# EAGLE design FInal_Board_Tesis_mini_4 (EAGLE 7.5.0)
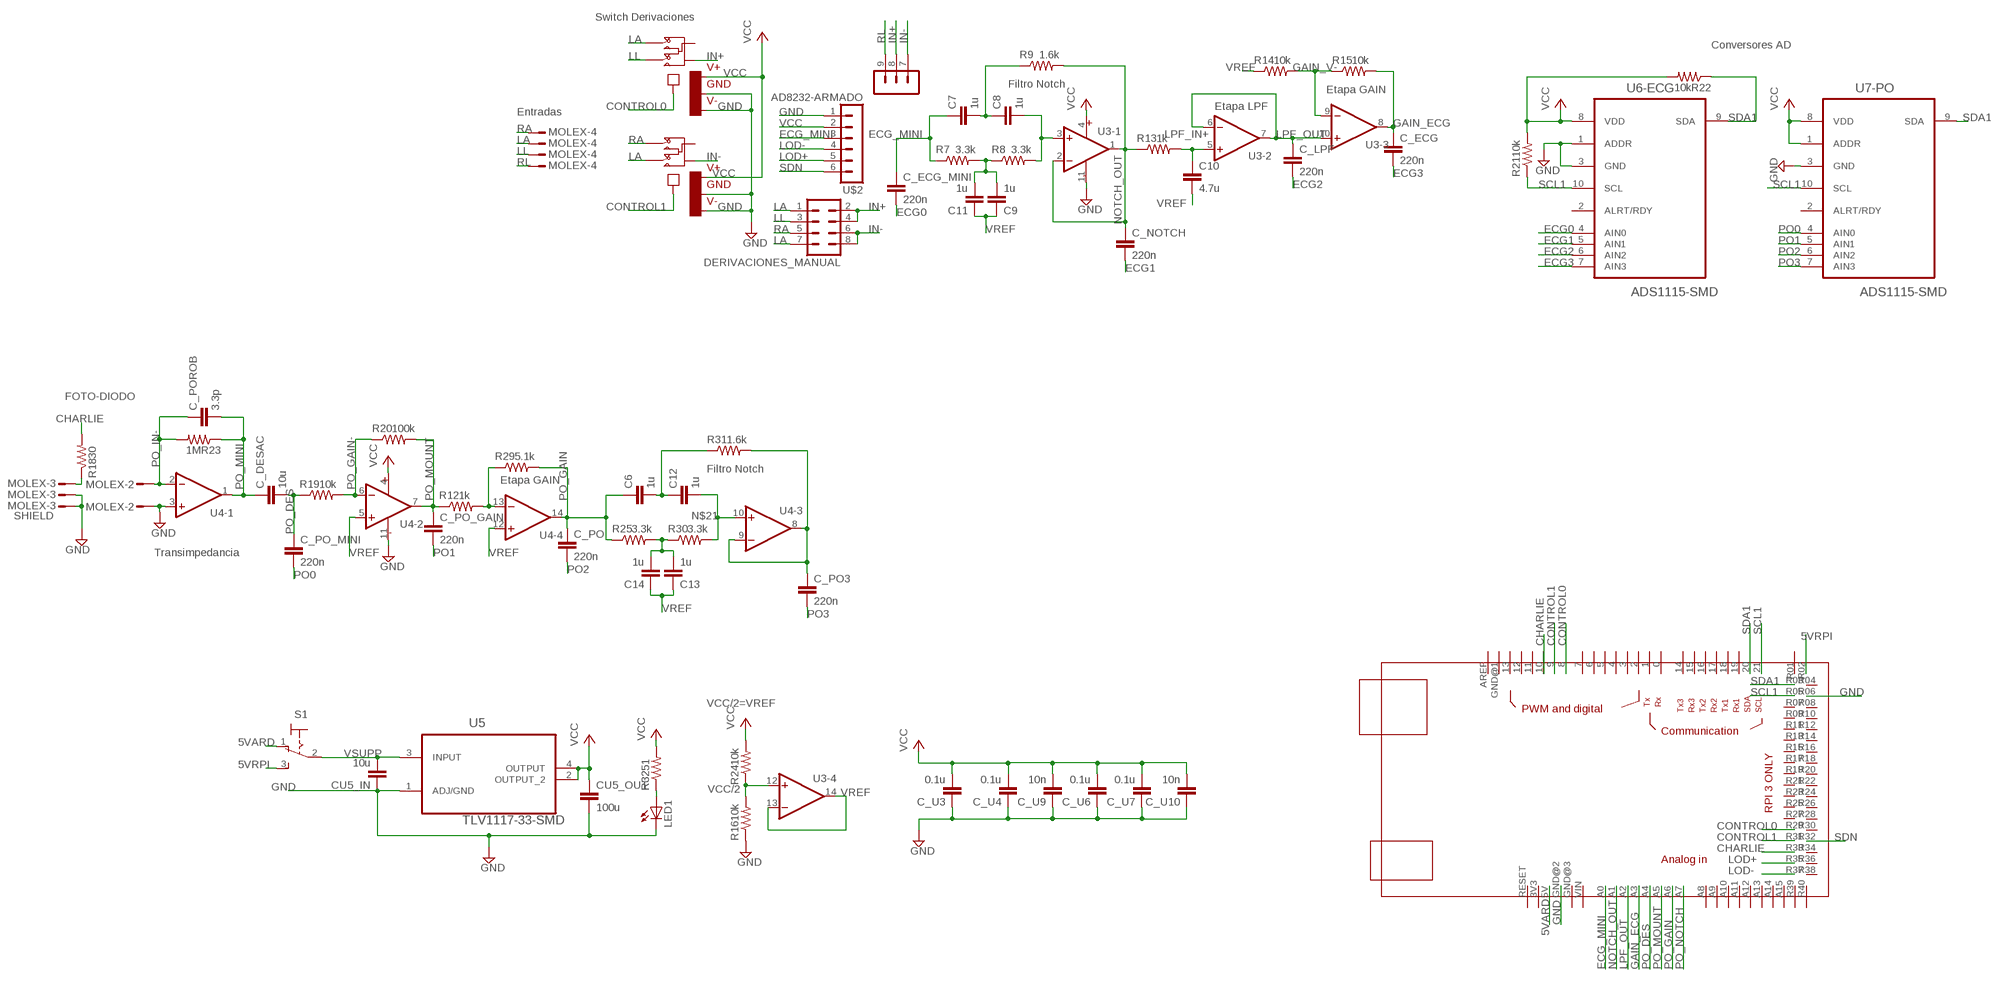
[diagram p0: schematic, sheet 1]

## Parts
C6  1u  C-EUC0805  [C0805]
C7  1u  C-EUC0805  [C0805]
C8  1u  C-EUC0805  [C0805]
C9  1u  C-EUC0805  [C0805]
C10  4.7u  C-EUC0805  [C0805]
C11  1u  C-EUC0805  [C0805]
C12  1u  C-EUC0805  [C0805]
C13  1u  C-EUC0805  [C0805]
C14  1u  C-EUC0805  [C0805]
C_DESAC  10u  C-EUC0805  [C0805]
C_ECG  220n  C-EUC0805  [C0805]
C_ECG_MINI  220n  C-EUC0805  [C0805]
C_LPF  220n  C-EUC0805  [C0805]
C_NOTCH  220n  C-EUC0805  [C0805]
C_PO  220n  C-EUC0805  [C0805]
C_PO3  220n  C-EUC0805  [C0805]
C_PO_GAIN  220n  C-EUC0805  [C0805]
C_PO_MINI  220n  C-EUC0805  [C0805]
C_POROB  3.3p  C-EUC0805  [C0805]
C_U3  0.1u  C-EUC0805  [C0805]
C_U4  0.1u  C-EUC0805  [C0805]
C_U6  0.1u  C-EUC0805  [C0805]
C_U7  0.1u  C-EUC0805  [C0805]
C_U9  10n  C-EUC0805  [C0805]
C_U10  10n  C-EUC0805  [C0805]
CU5_IN  10u  C-EUC0805  [C0805]
CU5_OUT  100u  C-EUC0805  [C0805]
DERIVACIONES_MANUAL  MA04-2  [MA04-2]
LED1  LED_E  [LED_1206]
R7  3.3k  R-US_M3216  [M3216]
R8  3.3k  R-US_M3216  [M3216]
R9  1.6k  R-US_M3216  [M3216]
R12  1k  R-US_M3216  [M3216]
R13  1k  R-US_M3216  [M3216]
R14  10k  R-US_M3216  [M3216]
R15  10k  R-US_M3216  [M3216]
R16  10k  R-US_M3216  [M3216]
R18  30  R-US_M3216  [M3216]
R19  10k  R-US_M3216  [M3216]
R20  100k  R-US_M3216  [M3216]
R21  10k  R-US_M3216  [M3216]
R22  10k  R-US_M3216  [M3216]
R23  1M  R-US_M3216  [M3216]
R24  10k  R-US_M3216  [M3216]
R25  3.3k  R-US_M3216  [M3216]
R29  5.1k  R-US_M3216  [M3216]
R30  3.3k  R-US_M3216  [M3216]
R31  1.6k  R-US_M3216  [M3216]
R32  51  R-US_M3216  [M3216]
S1  320-916  [320-916]
U3  OPA4348-SMD  [14TSSOP]
U4  OPA4348-SMD  [14TSSOP]
U5  TLV1117-33-SMD  [SOT223]
U6-ECG  ADS1115-SMD  [10MSOP]
U7-PO  ADS1115-SMD  [10MSOP]
U9  MAX4528-SMD  [8MSOP-C/PTO]
U10  MAX4528-SMD  [8MSOP-C/PTO]
U$1  MEGA_DEVICE  [MEGABOX]
U$2  AD8232-ARMADO  [PINES-ECG]
U$3  MOLEX-3  [MOLEX-3]
U$4  MOLEX-2  [MOLEX-2]
U$5  MOLEX-4  [MOLEX-4]

## Nets
5VARD: S1.1(O) U$1.5V
5VRPI: S1.3(S) U$1.R02(5V1)
CHARLIE: R18.2 U$1.10 U$1.R33(GPIO13)
CONTROL0: U9.4(IN) U$1.8 U$1.R29(GPIO5)
CONTROL1: U10.4(IN) U$1.9 U$1.R31(GPIO6)
ECG0: C_ECG_MINI.2 U6-ECG.4(AIN0)
ECG1: C_NOTCH.2 U6-ECG.5(AIN1)
ECG2: C_LPF.2 U6-ECG.6(AIN2)
ECG3: C_ECG.2 U6-ECG.7(AIN3)
ECG_MINI: C7.1 C_ECG_MINI.1 R7.1 U$1.A0 U$2.3(OUT)
GAIN_ECG: C_ECG.1 R15.2 U3.8(-3:OUT) U$1.A3
GAIN_V-: R14.2 R15.1 U3.9(-3:-IN)
GND: C_U3.1 C_U4.1 C_U6.1 C_U7.1 C_U9.1 C_U10.1 CU5_IN.1 CU5_OUT.2 LED1.C R16.1 U3.11(V-) U4.3(-1:+IN) U4.11(V-) U5.1(ADJ/GND) U6-ECG.1(ADDR) U6-ECG.3(GND) U7-PO.3(GND) U9.3(GND) U9.5(V-) U10.3(GND) U10.5(V-) U$1.GND@2(GND) U$1.R06(GND) U$2.1(GND) U$3.2 U$3.3 U$4.2
IN+: DERIVACIONES_MANUAL.2 DERIVACIONES_MANUAL.4 U9.6(Y) U$2.8(LA)
IN-: DERIVACIONES_MANUAL.6 DERIVACIONES_MANUAL.8 U10.6(Y) U$2.7(RA)
LA: DERIVACIONES_MANUAL.1 DERIVACIONES_MANUAL.7 U9.1(A) U10.2(B) U$5.2
LL: DERIVACIONES_MANUAL.3 U9.2(B) U$5.3
LOD+: U$1.R35(GPIO19) U$2.5(LOD+)
LOD-: U$1.R37(GPIO26) U$2.4(LOD-)
LPF_IN+: C10.1 R13.2 U3.5(-2:+IN)
LPF_OUT: C_LPF.1 U3.6(-2:-IN) U3.7(-2:OUT) U3.10(-3:+IN) U$1.A2
N$1: C6.2 C12.1 R31.1
N$2: C7.2 C8.1 R9.1
N$3: C8.2 R8.2 U3.3(-1:+IN)
N$4: C9.2 C11.2 R7.2 R8.1
N$5: R18.1 U$3.1
N$6: C13.2 C14.2 R25.2 R30.1
N$8: R12.2 R29.1 U4.13(-4:-IN)
N$9: LED1.A R32.1
N$21: C12.2 R30.2 U4.10(-3:+IN)
NOTCH_OUT: C_NOTCH.1 R9.2 R13.1 U3.1(-1:OUT) U3.2(-1:-IN) U$1.A1
PO0: C_PO_MINI.2 U7-PO.4(AIN0)
PO1: C_PO_GAIN.2 U7-PO.5(AIN1)
PO2: C_PO.2 U7-PO.6(AIN2)
PO3: C_PO3.2 U7-PO.7(AIN3)
PO_DES: C_DESAC.2 C_PO_MINI.1 R19.1 U$1.A4
PO_GAIN: C6.1 C_PO.1 R25.1 R29.2 U4.14(-4:OUT) U$1.A6
PO_GAIN-: R19.2 R20.1 U4.6(-2:-IN)
PO_IN-: C_POROB.1 R23.2 U4.2(-1:-IN) U$4.1
PO_MINI: C_DESAC.1 C_POROB.2 R23.1 U4.1(-1:OUT)
PO_MOUNT: C_PO_GAIN.1 R12.1 R20.2 U4.7(-2:OUT) U$1.A5
PO_NOTCH: C_PO3.1 R31.2 U4.8(-3:OUT) U4.9(-3:-IN) U$1.A7
RA: DERIVACIONES_MANUAL.5 U10.1(A) U$5.1
RL: U$2.9(RL) U$5.4
SCL1: R21.1 U6-ECG.10(SCL) U7-PO.10(SCL) U$1.21 U$1.R05(SCL1)
SDA1: R22.1 U6-ECG.9(SDA) U7-PO.9(SDA) U$1.20 U$1.R03(SDA1)
SDN: U$1.R32(GPIO12) U$2.6(!SDN)
VCC: C_U3.2 C_U4.2 C_U6.2 C_U7.2 C_U9.2 C_U10.2 CU5_OUT.1 R21.2 R22.2 R24.2 R32.2 U3.4(V+) U4.4(V+) U5.2(OUTPUT_2) U5.4(OUTPUT) U6-ECG.8(VDD) U7-PO.1(ADDR) U7-PO.8(VDD) U9.8(V+) U10.8(V+) U$2.2(3.3V)
VCC/2: R16.2 R24.1 U3.12(-4:+IN)
VREF: C9.1 C10.2 C11.1 C13.1 C14.1 R14.1 U3.13(-4:-IN) U3.14(-4:OUT) U4.5(-2:+IN) U4.12(-4:+IN)
VSUPP: CU5_IN.2 S1.2(P) U5.3(INPUT)
Unconnected: U6-ECG.2(ALRT/RDY) U7-PO.2(ALRT/RDY) U9.7(X) U10.7(X) U$1.0 U$1.1 U$1.2 U$1.3 U$1.3V3 U$1.4 U$1.5 U$1.6 U$1.7 U$1.11 U$1.12 U$1.13 U$1.14 U$1.15 U$1.16 U$1.17 U$1.18 U$1.19 U$1.A8 U$1.A9 U$1.A10 U$1.A11 U$1.A12 U$1.A13 U$1.A14 U$1.A15 U$1.AREF U$1.GND@1(GND) U$1.GND@3(GND) U$1.R01(3.3V) U$1.R04(5V2) U$1.R07(GCLK) U$1.R08(TXD0) U$1.R09(GND) U$1.R10(RXD0) U$1.R11(GEN0) U$1.R12(GEN1) U$1.R13(GEN2) U$1.R14(GND) U$1.R15(GEN3) U$1.R16(GEN4) U$1.R17(3.3V) U$1.R18(GEN5) U$1.R19(SPI_MOSI) U$1.R20(GND) U$1.R21(SPI_MISO) U$1.R22(GEN6) U$1.R23(SPI_CLK) U$1.R24(SPI_CE0_N) U$1.R25(GND) U$1.R26(SPI_CE1_N) U$1.R27(ID_SD) U$1.R28(ID_SC) U$1.R30(GND) U$1.R34(GND) U$1.R36(GPIO16) U$1.R38(GPIO20) U$1.R39(GND) U$1.R40(GPIO21) U$1.RESET U$1.VIN

## Notes on the sheet
- Switch Derivaciones
- Conversores AD
- Filtro Notch
- Etapa GAIN
- Etapa LPF
- Entradas
- FOTO-DIODO
- Filtro Notch
- Etapa GAIN
- SHIELD
- Transimpedancia
- VCC/2=VREF

## Library data of the parts
C6-C14 C_DESAC C_ECG C_ECG_MINI C_LPF C_NOTCH C_PO C_PO3 C_PO_GAIN C_PO_MINI C_POROB C_U3 C_U4 C_U6 C_U7 C_U9 C_U10 CU5_IN CU5_OUT = rcl:C-EU: CAPACITOR, European symbol
DERIVACIONES_MANUAL = con-lstb:MA04-2: PIN HEADER; OC_FARNELL: unknown; OC_NEWARK: unknown
LED1 = eagle-ltspice:LED_E: LED Source: http://www.osram.convergy.de Source: www.luxeon.com Source: www.kingbright.com; SPICEMODEL: NONE; SPICEPREFIX: D; SPICETYPE: diode
R7-R9 R12-R16 R18-R25 R29-R32 = resistor:R-US_: RESISTOR, American symbol
S1 = switch:320-916: TOGGLE SWITCH distributor RS Components
U3 U4 = PersonalLibrary:OPA4348-SMD: RAIL-TO-RAIL OPERATIONAL AMPLIFIER; MPN: OPA4348AQPWRQ1; OC_FARNELL: -; OC_NEWARK: 74R6506; PACKAGE: TSSOP-20; SUPPLIER: Texas Instruments
U5 = PersonalLibrary:TLV1117-33-SMD: V REG, LDO, 3.3V, 0.8A; MPN: TLV1117-33IDCY; OC_FARNELL: 1703385; OC_NEWARK: 67K8522; PACKAGE: SOT-223-3; SUPPLIER: TEXAS INSTRUMENTS
U6-ECG U7-PO = PersonalLibrary:ADS1115-SMD: ADC
U9 U10 = PersonalLibrary:MAX4528-SMD
U$1 = ArduinoMegaSymbol_GPIO:MEGA_DEVICE: mega card as device
U$2 = PersonalLibrary:AD8232-ARMADO
U$3 = PersonalLibrary:MOLEX-3
U$4 = PersonalLibrary:MOLEX-2
U$5 = PersonalLibrary:MOLEX-4

## Board
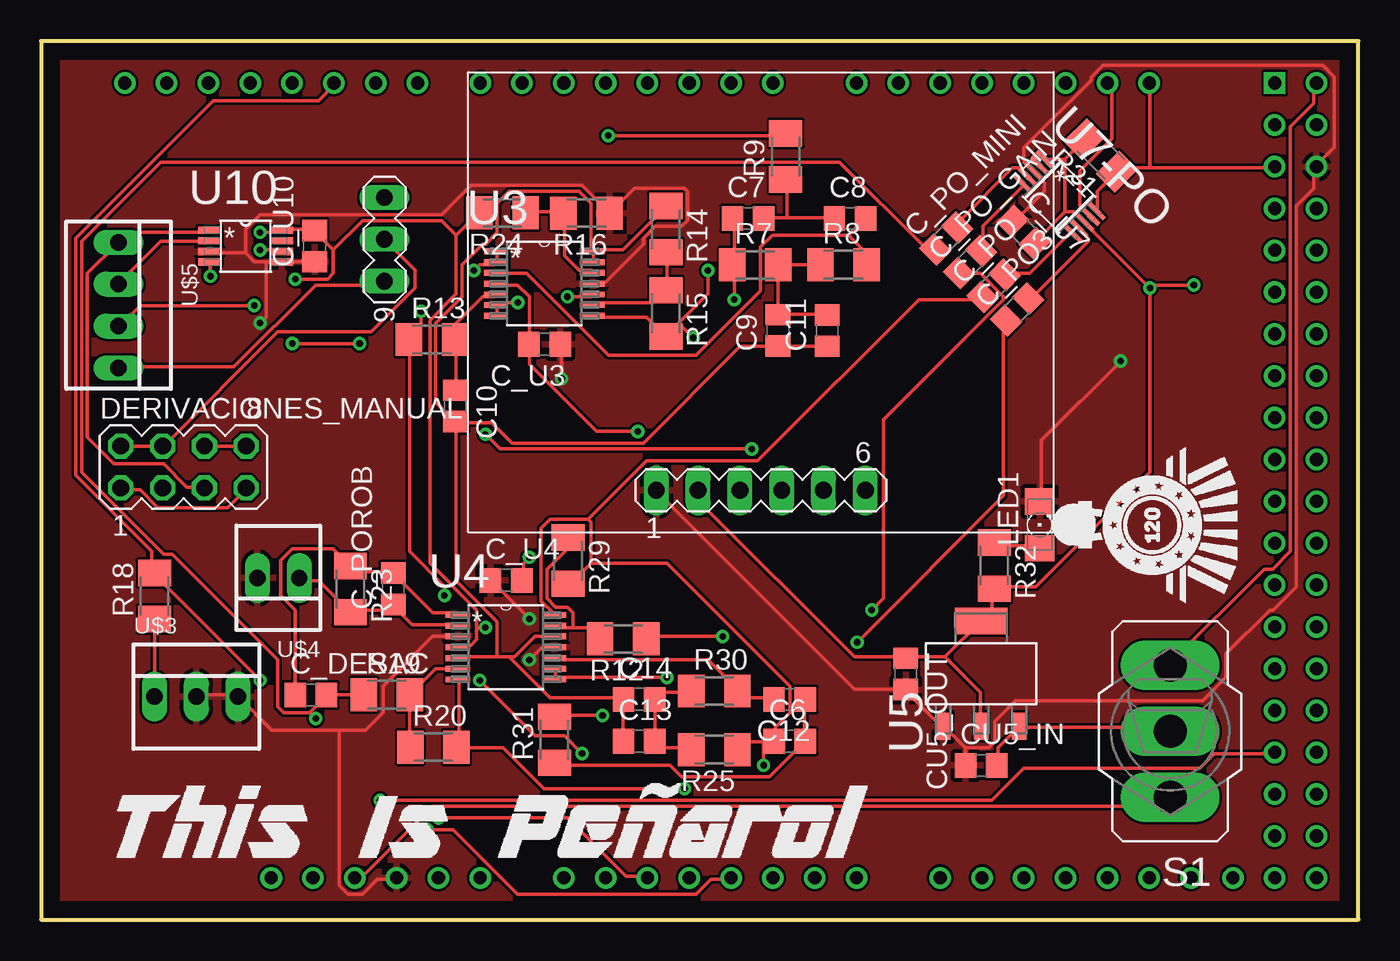
[diagram p1: board, top side]
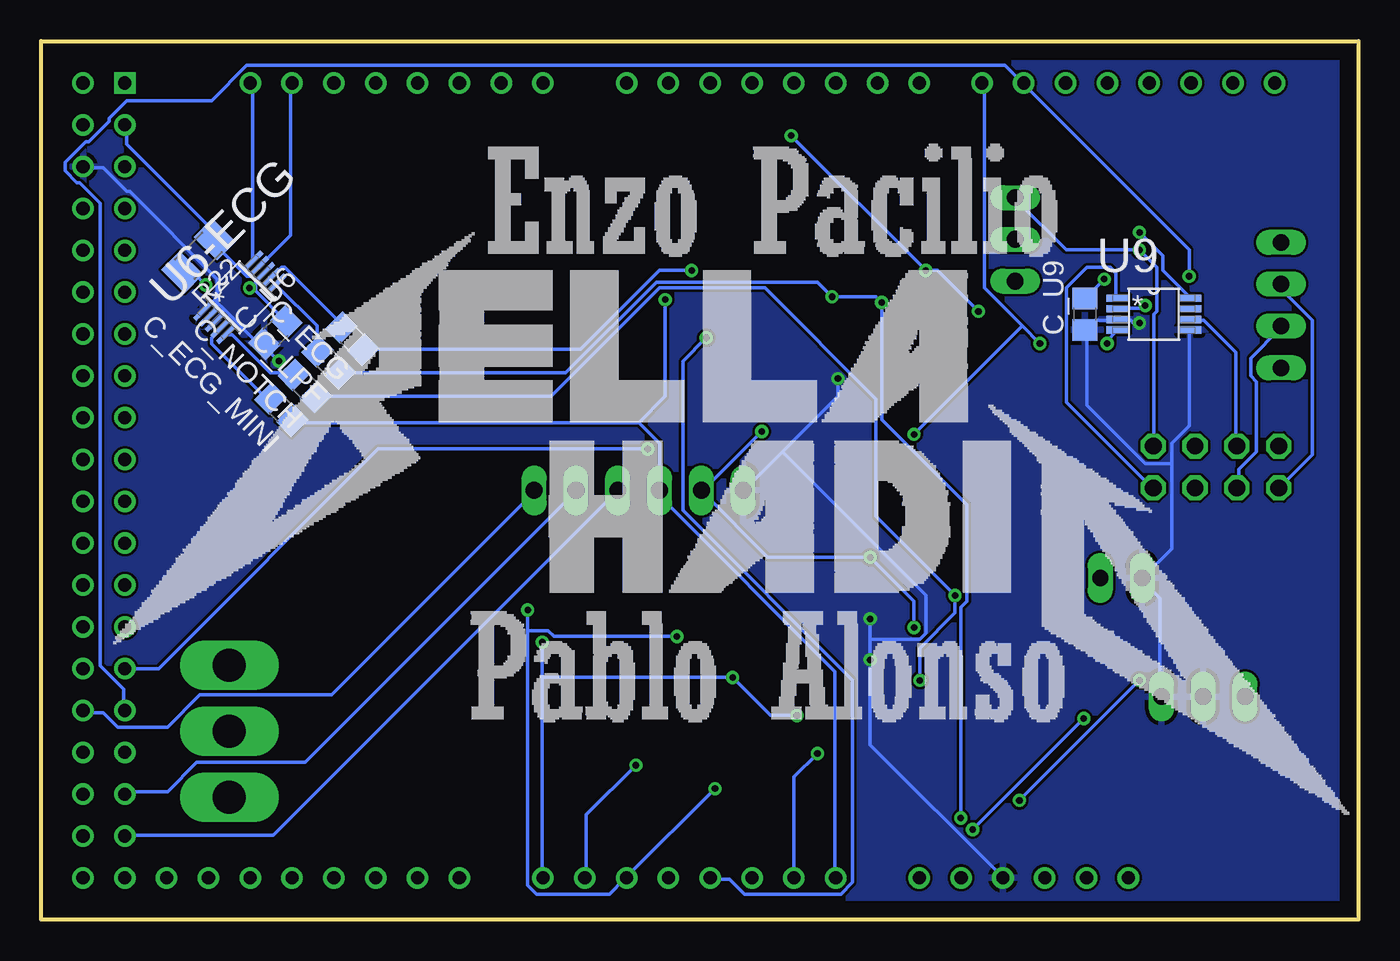
[diagram p2: board, bottom side, seen from below]

Size 80.01 x 53.34 mm. Coordinates in mm from the lower left corner, seen from the top.
Copper layers (1*16): Top 0.035mm / dielectric 1.6mm / Bottom 0.035mm
Design rules "PCBWayPCB": minimum track width 8mil, minimum drill 0.4mm, track to track 6mil, track to pad 6mil, pad to pad 6mil, via to via 6mil, smd to smd 6mil, copper to edge 40mil, drill to drill 8mil, minimum pad ring 10mil, minimum via ring 8mil, stop-mask expansion 4mil, vias tented up to drill 0mil, thermal gap 10mil

### Footprints (pad centres in the part's own frame; a part is rotated, then mirrored left to right if it is on the bottom)
C0805 = smd 1.3 x 1.5: 1 -0.95,0; 2 0.95,0
MA04-2 = drill 1.016 octagon: 1 -3.81,-1.27; 2 -3.81,1.27; 3 -1.27,-1.27; 4 -1.27,1.27; 5 1.27,-1.27; 6 1.27,1.27; 7 3.81,-1.27; 8 3.81,1.27
LED_1206 = smd 1.6 x 1.803: A -1.422,0; C 1.422,0
M3216 = smd 1.6 x 2: 1 -1.4,0; 2 1.4,0
320-916 = drill 2.007 long: 1 0,4.013; 2 0,0; 3 0,-4.013
14TSSOP = smd 1.473 x 0.356: 1 -2.921,1.956; 2 -2.921,1.295; 3 -2.921,0.66; 4 -2.921,0; 5 -2.921,-0.66; 6 -2.921,-1.295; 7 -2.921,-1.956; 8 2.921,-1.956; 9 2.921,-1.295; 10 2.921,-0.66; 11 2.921,0; 12 2.921,0.66; 13 2.921,1.295; 14 2.921,1.956
SOT223 = smd 1.626 x 0.889: 1 -3.2,2.311; 2 -3.2,0; 3 -3.2,-2.311 | smd 1.626 x 3.175: 4 3.2,0
10MSOP = smd 1.422 x 0.279: 1 -2.184,0.991; 2 -2.184,0.508; 3 -2.184,0; 4 -2.184,-0.508; 5 -2.184,-0.991; 6 2.184,-0.991; 7 2.184,-0.508; 8 2.184,0; 9 2.184,0.508; 10 2.184,0.991
8MSOP-C/PTO = smd 1.422 x 0.432: 1 -2.184,0.965; 2 -2.184,0.33; 3 -2.184,-0.33; 4 -2.184,-0.965; 5 2.184,-0.965; 6 2.184,-0.33; 7 2.184,0.33; 8 2.184,0.965
MEGABOX = drill 0.8: 0 12.7,24.13; 1 10.16,24.13; 2 7.62,24.13; 3 5.08,24.13; 3V3 -15.24,-24.13; 4 2.54,24.13; 5 0,24.13; 5V -12.7,-24.13; 6 -2.54,24.13; 7 -5.08,24.13; 8 -8.89,24.13; 9 -11.43,24.13; 10 -13.97,24.13; 11 -16.51,24.13; 12 -19.05,24.13; 13 -21.59,24.13; 14 17.78,24.13; 15 20.32,24.13; 16 22.86,24.13; 17 25.4,24.13; 18 27.94,24.13; 19 30.48,24.13; 20 33.02,24.13; 21 35.56,24.13; A0 0,-24.13; A1 2.54,-24.13; A2 5.08,-24.13; A3 7.62,-24.13; A4 10.16,-24.13; A5 12.7,-24.13; A6 15.24,-24.13; A7 17.78,-24.13; A8 22.86,-24.13; A9 25.4,-24.13; A10 27.94,-24.13; A11 30.48,-24.13; A12 33.02,-24.13; A13 35.56,-24.13; A14 38.1,-24.13; A15 40.64,-24.13; AREF -26.67,24.13; GND@1 -24.13,24.13; GND@2 -10.16,-24.13; GND@3 -7.62,-24.13; R02 45.72,24.13; R03 43.18,21.59; R04 45.72,21.59; R05 43.18,19.05; R06 45.72,19.05; R07 43.18,16.51; R08 45.72,16.51; R09 43.18,13.97; R10 45.72,13.97; R11 43.18,11.43; R12 45.72,11.43; R13 43.18,8.89; R14 45.72,8.89; R15 43.18,6.35; R16 45.72,6.35; R17 43.18,3.81; R18 45.72,3.81; R19 43.18,1.27; R20 45.72,1.27; R21 43.18,-1.27; R22 45.72,-1.27; R23 43.18,-3.81; R24 45.72,-3.81; R25 43.18,-6.35; R26 45.72,-6.35; R27 43.18,-8.89; R28 45.72,-8.89; R29 43.18,-11.43; R30 45.72,-11.43; R31 43.18,-13.97; R32 45.72,-13.97; R33 43.18,-16.51; R34 45.72,-16.51; R35 43.18,-19.05; R36 45.72,-19.05; R37 43.18,-21.59; R38 45.72,-21.59; R39 43.18,-24.13; R40 45.72,-24.13; RESET -17.78,-24.13; VIN -5.08,-24.13 | drill 0.8 square: R01 43.18,24.13
PINES-ECG = drill 1.016 long: 1 -11.43,3.81; 2 -11.43,1.27; 3 -11.43,-1.27; 4 -11.43,-3.81; 5 -11.43,-6.35; 6 -11.43,-8.89; 7 6.35,20.32; 8 3.81,20.32; 9 1.27,20.32
MOLEX-3 = drill 1 long: 1 -2.54,0; 2 0,0; 3 2.54,0
MOLEX-2 = drill 1 long: 1 -1.27,0; 2 1.27,0
MOLEX-4 = drill 1 long: 1 -3.81,0; 2 -1.27,0; 3 1.27,0; 4 3.81,0

### Placement (x,y rotation side)
C6  45.47,10.83 0 top
C7  42.94,42.57 0 top
C8  49.13,42.57 0 top
C9  44.76,35.78 90 top
C10  25.17,31.19 270 top
C11  47.75,35.77 90 top
C12  45.47,13.37 180 top
C13  36.33,10.83 0 top
C14  36.33,13.37 0 top
C_DESAC  16.38,13.64 0 top
C_ECG  61.11,35.27 135 bottom
C_ECG_MINI  65.42,30.96 135 bottom
C_LPF  62.54,33.84 135 bottom
C_NOTCH  63.99,32.41 135 bottom
C_PO  57.86,38.49 45 top
C_PO3  59.29,37.04 45 top
C_PO_GAIN  56.43,39.93 45 top
C_PO_MINI  54.97,41.35 45 top
C_POROB  21.39,20.09 90 top
C_U3  30.57,34.94 180 top
C_U4  28.24,20.6 0 top
C_U6  65.79,35.64 45 bottom
C_U7  59.68,41.75 315 top
C_U9  16.61,36.76 90 bottom
C_U10  16.61,40.9 90 top
CU5_IN  57.1,9.36 0 top
CU5_OUT  52.51,14.92 270 top
DERIVACIONES_MANUAL  8.65,27.48 0 top
LED1  60.65,23.97 90 top
R7  43.38,39.76 0 top
R8  48.74,39.76 0 top
R9  45.22,46.34 90 top
R12  35.35,17.04 180 top
R13  23.75,35.22 0 top
R14  37.95,41.92 270 top
R15  37.95,36.82 270 top
R16  33.13,42.9 180 top
R18  6.88,19.65 90 top
R19  21.01,13.65 0 top
R20  23.83,10.48 0 top
R21  64.36,46.41 135 top
R22  70.46,40.31 225 bottom
R23  18.78,20.07 270 top
R24  28.02,42.91 180 top
R25  40.89,10.32 180 top
R29  32.01,21.79 270 top
R30  40.89,13.88 0 top
R31  31.17,10.92 90 top
R32  57.89,21.49 270 top
S1  68.58,11.43 180 top
U3  30.56,38.62 0 top
U4  28.23,16.54 0 top
U5  57.1,14.94 90 top
U6-ECG  67.94,37.8 45 bottom
U7-PO  61.84,43.9 315 top
U9  12.42,36.77 0 bottom
U10  12.42,40.9 0 top
U$1  31.75,26.67 0 top
U$2  41.17,37.5 90 top
U$3  9.42,13.54 0 top
U$4  14.4,20.75 180 top
U$5  4.7,37.31 270 top

### Tracks (layer width: path | path; a pad name or v marks a point on that pad's centre or on a via)
5VARD
  Top 0.203: U$1.5V 19.17,2.62 19.52,2.62 23.79,6.89 68.06,6.89 68.42,7.24 S1.1
5VRPI
  Top 0.203: U$1.R02 77.31,50.62 77.31,49.56 75.88,48.14 75.88,22.35 74.82,21.29 74.28,21.29 68.6,15.6 S1.3
CHARLIE  (via drill 0.4)
  Top 0.203: U$1.10 17.74,50.62 16.86,49.74 10.45,49.74 2.1,41.38 2.1,26.98 6.72,22.35 6.72,21.11 R18.2 6.9,20.93 v13.3,14.53 | v20.59,7.24 57.75,7.24 59.71,9.2 70.37,9.2 71.26,10.09 74.82,10.09 U$1.R33
  Bottom 0.203: v13.3,14.53 v20.59,7.24
CONTROL0  (via drill 0.4)
  Top 0.203: v19.34,34.98 v15.26,34.98 | v43.17,28.58 27.88,28.58 v26.99,29.47
  Bottom 0.203: v15.26,34.98 15.26,35.16 14.72,35.69 U9.4 | 20.41,36.04 22.72,38.36 22.72,50.62 U$1.8 | 20.41,36.04 v19.34,34.98 | v43.17,28.58 59.53,28.58 72.86,15.24 74.82,15.24 U$1.R29 | 20.41,36.04 v26.99,29.47
CONTROL1  (via drill 0.4)
  Top 0.203: v10.28,39.07 10.28,39.78 U10.4
  Bottom 0.203: v10.28,39.07 10.28,40.67 20.23,50.62 U$1.9 20.41,50.8 21.48,51.87 67.53,51.87 69.66,49.74 74.82,49.74 75.88,48.67 75.88,48.49 77.13,47.25 77.31,47.25 78.55,46 78.55,45.47 77.84,44.76 77.66,44.76 76.42,43.51 76.42,15.42 75,14 75,12.75 U$1.R31
ECG0
  Bottom 0.203: U6-ECG.4 69.13,35.87 69.66,35.33 69.66,34.98 66.46,31.78 66.11,31.78 C_ECG_MINI.2
ECG1
  Bottom 0.203: U6-ECG.5 68.77,35.51 68.42,35.51 66.11,33.2 64.68,33.2 C_NOTCH.2
ECG2
  Bottom 0.203: U6-ECG.6 65.75,38.53 63.26,36.04 63.26,34.62 C_LPF.2
ECG3
  Bottom 0.203: U6-ECG.7 65.93,39.07 65.39,39.6 65.22,39.6 61.66,36.04 C_ECG.2
ECG_MINI  (via drill 0.4)
  Top 0.203: C7.1 42.1,42.45 42.1,39.78 R7.1 42.1,39.6 v42.1,37.64
  Bottom 0.203: 43.7,30.18 64.68,30.18 C_ECG_MINI.1 | 43.7,30.18 42.46,28.93 42.46,26.09 U$2.3 42.28,25.91 42.28,25.55 31.79,15.06 31.79,2.62 U$1.A0 | v42.1,37.64 42.1,31.78 43.7,30.18
GAIN_ECG  (via drill 0.4)
  Top 0.203: U3.8 33.57,36.58 36.77,36.58 37.84,35.51 R15.2 38.01,35.51 38.72,36.22 | v40.5,39.42 40.5,38 38.72,36.22 | 38.72,36.22 v39.61,35.33
  Bottom 0.203: v40.5,39.42 42.46,39.42 47.26,34.62 60.42,34.62 C_ECG.1 | v39.61,35.33 41.04,33.91 41.04,24.84 30.72,14.53 30.72,2.26 31.43,1.55 37.3,1.55 38.19,2.44 39.26,2.44 U$1.A3
GAIN_V-
  Top 0.203: U3.9 33.57,37.47 37.12,37.47 37.84,38.18 R15.1 38.01,38.36 38.01,40.49 R14.2
GND  (via drill 0.4)
  Top 0.203: C_U10.1 16.5,39.96 14.72,39.96 U10.5 14.54,39.96 13.65,39.96 | 12.41,40.49 10.28,40.49 U10.3 | 12.41,40.49 12.94,39.96 13.65,39.96 | U3.11 33.57,38.71 34.28,38.71 36.59,41.02 36.59,41.38 37.3,42.09 38.9,42.09 39.26,42.45 39.26,44.22 39.08,44.4 36.06,44.4 34.64,42.98 R16.1 34.46,42.98 32.86,44.58 26.1,44.58 24.32,42.8 13.3,42.8 12.41,41.91 12.41,40.49 | v29.66,15.78 30.37,16.49 31.08,16.49 U4.11 | v29.66,18.26 27.35,20.58 C_U4.1 | 18.1,11.51 14.01,11.51 12.05,13.46 U$3.3 11.88,13.64 9.57,13.64 U$3.2 | 18.1,11.51 19.7,11.51 20.77,12.58 20.77,14.18 23.79,17.2 25.21,17.2 U4.3 | 18.1,11.51 18.1,2.08 18.63,1.55 19.52,1.55 20.41,2.44 21.48,2.44 U$1.GND@2 | 13.65,39.96 13.65,36.58 v13.3,36.22 | C_U7.1 59.17,42.45 60.95,44.22 60.95,44.76 60.42,45.29 U7-PO.3 60.24,45.47 59.71,46 59.71,46.89 63.79,50.98 63.79,51.16 64.51,51.87 77.84,51.87 78.55,51.16 78.55,46.89 77.49,45.82 U$1.R06 77.31,45.65 77.31,44.4 76.24,43.33 76.24,20.22 74.82,18.8 74.64,18.8 71.97,16.13 71.97,14.71 70.55,13.29 59.17,13.29 57.93,12.04 57.93,10.8 57.57,10.44 56.15,10.44 | v65.57,33.91 60.77,29.11 60.77,25.55 LED1.C | 56.15,10.44 56.15,9.37 CU5_IN.1 | 56.15,10.44 54.9,11.69 U5.1 54.73,11.69 52.59,13.82 CU5_OUT.2 52.42,14 49.39,14 37.48,25.91 U$2.1 | v31.61,32.84 31.61,34.8 C_U3.1
  Bottom 0.203: U$1.GND@2 21.66,2.62 29.66,10.62 v29.66,15.78 29.66,17.02 | 29.66,17.02 v29.66,18.26 | 11.34,27.69 11.34,22.53 13.12,20.75 U$4.2 13.12,20.58 12.05,19.51 12.05,13.64 U$3.3 | 11.34,27.69 11.34,28.93 10.28,30 10.28,35.69 U9.5 | 11.34,27.69 12.94,27.69 16.5,31.24 16.5,35.69 C_U9.1 16.5,35.87 15.97,36.4 14.72,36.4 U9.3 14.54,36.4 13.83,36.4 13.65,36.22 v13.3,36.22 | 68.95,37.11 68.95,36.93 69.48,36.4 U6-ECG.3 | 69.31,37.47 69.48,37.64 70.02,37.11 U6-ECG.1 | 69.31,37.47 68.95,37.11 | 68.95,37.11 66.82,34.98 66.46,34.98 C_U6.1 66.46,34.8 v65.57,33.91 | 69.31,37.47 69.31,38.89 74.64,44.22 74.82,44.22 76.24,45.65 77.31,45.65 U$1.R06 | v31.61,32.84 31.61,31.78 34.99,28.4 | 34.99,28.4 37.3,26.09 U$2.1 | 29.66,17.02 26.63,17.02 26.28,17.38 26.28,19.69 34.99,28.4
  pour Bottom: 79.83,53.38 79.83,-0.15 0.02,-0.15 0.03,53.3
  pour Top: 79.91,53.38 79.91,0 0.09,0 0.09,53.3 0.02,53.3
IN+
  Top 0.203: DERIVACIONES_MANUAL.2 4.94,28.75 7.25,28.75 DERIVACIONES_MANUAL.4 7.43,28.75 14.37,35.69 20.06,35.69 22.72,38.36 22.72,39.42 20.94,41.2 U$2.8
  Bottom 0.203: U9.6 10.1,36.4 9.39,36.4 7.43,34.44 7.43,28.75 DERIVACIONES_MANUAL.4
IN-  (via drill 0.4)
  Top 0.203: DERIVACIONES_MANUAL.6 12.41,28.75 DERIVACIONES_MANUAL.8 | v13.3,40.67 14.54,40.67 U10.6
  Bottom 0.203: U$2.7 20.77,43.69 17.74,40.67 v13.3,40.67 12.23,39.6 12.23,36.93 12.41,36.76 12.41,28.75 DERIVACIONES_MANUAL.8
LA
  Top 0.203: U10.2 10.1,41.2 7.25,41.2 4.76,38.71 U$5.2 | DERIVACIONES_MANUAL.1 4.94,26.09 6.01,26.09 7.08,25.02 11.34,25.02 12.41,26.09 DERIVACIONES_MANUAL.7
  Bottom 0.203: U9.1 14.72,37.82 14.72,39.25 15.08,39.6 16.5,39.6 17.74,38.36 17.74,31.42 12.59,26.27 DERIVACIONES_MANUAL.7 | U$5.2 4.59,38.53 4.59,38.18 2.81,36.4 2.81,28.22 4.76,26.27 DERIVACIONES_MANUAL.1
LL  (via drill 0.4)
  Top 0.203: v12.94,37.29 6.01,37.29 4.76,36.04 U$5.3
  Bottom 0.203: v12.94,37.29 13.12,37.11 14.54,37.11 U9.2 | DERIVACIONES_MANUAL.3 7.25,26.27 7.25,27.33 6.19,28.4 6.19,32.67 6.54,33.02 6.54,34.09 4.76,35.87 U$5.3
LOD+
  Bottom 0.203: U$1.R35 74.82,7.77 72.33,7.77 70.55,9.55 63.97,9.55 47.61,25.91 U$2.5
LOD-
  Bottom 0.203: U$1.R37 74.82,5.11 65.93,5.11 45.13,25.91 U$2.4
LPF_IN+
  Top 0.203: U3.5 27.52,37.82 26.81,37.82 25.21,36.22 25.21,35.33 R13.2 25.21,35.16 25.21,32.31 C10.1
LPF_OUT  (via drill 0.4)
  Top 0.203: U3.7 27.7,36.76 27.7,37.29 U3.6 27.7,37.47 v28.95,37.47 | v31.97,37.82 33.39,37.82 U3.10 | v24.15,6.17 31.97,6.17 35.52,2.62 36.77,2.62 U$1.A2
  Bottom 0.203: C_LPF.1 61.84,33.2 48.15,33.2 42.64,38.71 32.86,38.71 v31.97,37.82 29.3,37.82 v28.95,37.47 28.95,30.36 23.79,25.2 23.79,19.33 24.15,18.98 v24.15,6.17
N$1
  Top 0.203: C12.1 46.37,13.29 46.37,10.97 C6.2 46.37,10.8 44.24,8.66 38.9,8.66 38.19,9.37 31.26,9.37 R31.1
N$2
  Top 0.203: 45.3,42.62 44.06,42.62 C7.2 | 45.3,42.62 48.15,42.62 C8.1 | 45.3,42.62 45.3,44.93 R9.1
N$3
  Top 0.203: 49.04,41.56 44.41,41.56 43.7,40.85 43.7,38.18 39.79,34.27 34.46,34.27 29.48,39.25 27.7,39.25 U3.3 | 49.04,41.56 49.93,42.45 C8.2 | 49.04,41.56 50.1,40.49 50.1,39.78 R8.2
N$4
  Top 0.203: 44.77,36.76 44.77,39.6 R7.2 44.95,39.78 47.26,39.78 R8.1 | 44.77,36.76 47.61,36.76 C11.2 | 44.77,36.76 C9.2
N$5
  Top 0.203: R18.1 6.9,18.09 6.9,13.64 U$3.1
N$6
  Top 0.203: R25.2 39.44,10.44 37.66,10.44 37.3,10.8 C13.2 37.3,10.97 37.3,13.29 C14.2 37.3,13.46 37.66,13.82 39.44,13.82 R30.1
N$8
  Top 0.203: 32.32,17.73 33.39,17.73 33.92,17.2 R12.2 | 32.32,17.73 31.26,17.73 U4.13 | 32.32,17.73 32.32,18.62 31.97,18.98 31.26,18.98 30.72,19.51 30.72,21.29 31.97,22.53 31.97,23.07 R29.1
N$9
  Top 0.203: LED1.A 60.59,22.71 58.1,22.71 57.93,22.89 R32.1
N$21
  Top 0.203: U4.10 31.26,15.78 40.5,15.78 42.28,14 R30.2 42.46,13.82 42.81,13.46 44.41,13.46 C12.2
NOTCH_OUT  (via drill 0.4)
  Top 0.203: U3.1 27.7,40.49 27.7,39.96 U3.2 27.52,39.78 26.63,39.78 v26.28,39.42 | v24.5,19.69 24.5,20.22 22.37,22.35 22.37,35.16 R13.1 22.37,35.33 23.08,36.04 v23.08,36.93 | v34.46,47.6 45.13,47.6 R9.2 | v32.86,10.09 31.79,11.15 30.01,11.15 v26.63,14.53
  Bottom 0.203: C_NOTCH.1 63.26,31.78 49.04,31.78 42.46,38.36 36.06,38.36 29.3,31.6 29.3,24.49 v24.5,19.69 24.5,18.62 26.63,16.49 v26.63,14.53 | v23.08,36.93 25.57,39.42 v26.28,39.42 v34.46,47.6 | v32.86,10.09 34.28,8.66 34.28,2.62 U$1.A1
PO0
  Top 0.203: U7-PO.4 59.88,45.11 59.35,45.65 58.99,45.65 55.79,42.45 55.79,42.09 C_PO_MINI.2
PO1
  Top 0.203: U7-PO.5 59.71,44.58 57.22,42.09 57.22,40.67 C_PO_GAIN.2
PO2
  Top 0.203: U7-PO.6 62.55,41.73 60.06,39.25 58.64,39.25 C_PO.2
PO3
  Top 0.203: U7-PO.7 63.08,41.91 63.62,41.38 63.62,41.2 60.06,37.64 C_PO3.2
PO_DES  (via drill 0.4)
  Top 0.203: R19.1 19.52,13.64 17.39,13.64 C_DESAC.2 17.21,13.46 16.32,12.58 | 16.32,12.58 14.72,12.58 14.37,12.93 14.37,15.78 7.97,22.18 7.43,22.18 2.45,27.15 2.45,41.2 7.25,46 48.5,46 53.66,40.85 54.19,40.85 C_PO_MINI.1 | v23.43,5.46 25.03,5.46 28.95,1.55 39.79,1.55 40.68,2.44 41.75,2.44 U$1.A4 | 16.32,12.58 v16.68,12.22
  Bottom 0.203: v16.68,12.22 v23.43,5.46
PO_GAIN  (via drill 0.4)
  Top 0.203: 43.88,10.8 42.81,10.8 42.46,10.44 R25.1 | 43.88,10.8 44.41,10.8 C6.1 | 43.88,10.8 v43.88,9.37 | 43.88,10.8 C6.1 | 33.21,24.31 30.9,24.31 30.37,23.78 30.37,19.33 31.08,18.62 U4.14 | 33.21,24.31 33.39,24.13 33.39,21.64 | 33.39,21.64 32.15,20.4 R29.2 | 33.21,24.31 36.77,27.87 43.53,27.87 53.3,37.64 57.04,37.64 C_PO.1 | 33.39,21.64 38.01,21.64 45.48,14.18 45.48,12.58 44.59,11.69 44.59,10.97 C6.1
  Bottom 0.203: v43.88,9.37 46.9,6.35 46.9,2.62 U$1.A6
PO_GAIN-
  Top 0.203: U4.6 25.21,15.24 23.97,15.24 22.54,13.82 R19.2 22.37,13.64 22.37,10.62 R20.1
PO_IN-
  Top 0.203: U4.2 25.21,17.91 22.54,17.91 21.48,18.98 C_POROB.1 21.3,18.98 21.12,18.8 18.81,18.8 R23.2 18.63,18.8 16.86,20.58 15.79,20.58 U$4.1
PO_MINI
  Top 0.203: U4.1 25.21,18.62 23.79,18.62 21.48,20.93 C_POROB.2 21.3,21.11 19.17,21.11 18.81,21.47 R23.1 18.63,21.64 17.74,22.53 15.26,22.53 14.54,21.82 14.54,19.69 15.43,18.8 C_DESAC.1
PO_MOUNT  (via drill 0.4)
  Top 0.203: U4.7 25.39,14.53 25.39,10.62 R20.2 25.39,10.44 28.06,10.44 30.55,7.95 v39.08,7.95 | v50.46,18.8 51.17,19.51 51.17,30.36 58.46,37.64 58.46,37.82 57.04,39.25 55.79,39.25 C_PO_GAIN.1 | v41.39,17.2 36.77,17.2 R12.1
  Bottom 0.203: 50.46,17.55 50.46,2.08 49.93,1.55 45.48,1.55 44.59,2.44 U$1.A5 44.41,2.62 v39.08,7.95 | 50.46,17.55 v50.46,18.8 | v41.39,17.2 48.86,17.2 49.21,17.55 50.46,17.55
PO_NOTCH  (via drill 0.4)
  Top 0.203: 31.26,14.71 31.26,15.24 U4.9 | v49.57,16.84 58.46,25.73 58.46,36.22 C_PO3.1 | v38.01,14.71 31.26,14.71 | 31.26,14.71 U4.8 | v34.1,12.4 31.26,12.4 R31.2
  Bottom 0.203: 49.57,14.71 49.57,2.62 U$1.A7 | 49.57,14.71 v49.57,16.84 | 49.57,14.71 v38.01,14.71 35.7,12.4 v34.1,12.4
RA
  Top 0.203: U10.1 10.1,41.73 5.3,41.73 4.76,41.2 U$5.1 4.59,41.02 2.81,39.25 2.81,29.29 4.41,27.69 7.43,27.69 8.85,26.27 9.74,26.27 DERIVACIONES_MANUAL.5
RL
  Top 0.203: U$5.4 4.76,33.56 11.7,33.56 16.68,38.53 20.59,38.53 20.77,38.71 U$2.9
SCL1
  Top 0.203: U7-PO.10 64.15,43.16 64.15,44.22 65.22,45.29 R21.1 65.39,45.47 65.57,45.65 67.35,45.65 | 67.35,45.65 74.82,45.65 U$1.R05 | 67.35,45.65 67.35,50.62 U$1.21
  Bottom 0.203: U6-ECG.10 67.17,40.13 67.17,50.62 U$1.21
SDA1
  Top 0.203: U7-PO.9 63.62,42.8 63.08,43.33 63.08,45.47 65.04,47.42 65.04,50.45 64.86,50.62 U$1.20
  Bottom 0.203: U$1.R03 74.82,48.14 74.82,47.07 69.48,41.73 69.48,41.38 R22.1 69.31,41.2 69.31,40.85 67.53,39.07 67.35,39.07 66.82,39.6 U6-ECG.9 66.64,39.78 64.86,41.56 64.86,50.62 U$1.20
SDN
  Bottom 0.203: U$1.R32 77.31,12.58 76.24,12.58 75.35,11.69 72.33,11.69 70.37,13.64 62.37,13.64 50.1,25.91 U$2.6
VCC  (via drill 0.4)
  Top 0.203: v15.43,38.89 17.39,38.89 17.74,39.25 17.74,40.67 | 17.74,40.67 16.68,41.73 C_U10.2 16.5,41.91 14.72,41.91 U10.8 14.54,41.73 v13.3,41.73 | 26.46,17.73 26.46,18.8 23.61,21.64 23.61,36.4 25.21,38 25.21,41.56 | 26.46,17.73 26.46,17.02 26.1,16.66 25.39,16.66 U4.4 | 25.21,41.56 26.46,42.8 R24.2 | 17.74,40.67 19.52,42.45 24.32,42.45 25.21,41.56 | 62.19,46.18 61.13,46.18 U7-PO.1 | 62.19,46.18 63.26,47.25 R21.2 | 62.19,42.98 62.73,42.98 63.26,42.45 U7-PO.8 63.44,42.27 67.17,38.53 67.35,38.53 | 62.19,42.98 60.42,41.2 C_U7.2 | 67.35,38.53 v70.02,38.53 | 67.35,38.53 v67.35,38.36 67.35,27.15 60.42,20.22 57.93,20.22 R32.2 57.75,20.04 57.75,18.8 57.22,18.26 U5.4 57.04,18.09 54.9,15.95 | 62.19,42.98 62.19,46.18 | 54.9,15.95 52.59,15.95 CU5_OUT.1 52.42,15.95 49.39,15.95 39.97,25.38 39.97,25.91 U$2.2 | 54.9,15.95 57.04,13.82 57.04,11.86 U5.2 | U3.4 27.7,38.53 28.95,38.53 29.66,37.82 29.66,34.98 C_U3.2 29.66,34.8 29.66,33.73 33.75,29.64 v36.24,29.64 | v29.66,22 29.3,21.64 29.3,20.75 C_U4.2 | v26.99,17.73 26.46,17.73
  Bottom 0.203: v15.43,38.89 16.5,37.82 C_U9.2 | v13.3,41.73 11.88,40.31 11.88,39.42 10.28,37.82 U9.8 | 66.99,38.36 66.99,38.18 65.22,36.4 C_U6.2 | 66.99,38.36 66.99,38.71 66.46,39.25 U6-ECG.8 | v70.02,38.53 70.73,39.25 71.44,39.25 R22.2 | v67.35,38.36 66.99,38.36 | v36.24,29.64 39.79,26.09 U$2.2 39.79,25.91 35.88,22 v29.66,22 26.99,19.33 v26.99,17.73
VCC/2
  Top 0.203: U3.12 33.39,39.42 32.68,39.42 31.79,40.31 31.79,42.8 R16.2 31.61,42.98 29.48,42.98 R24.1
VREF
  Top 0.203: U3.13 33.57,39.96 33.57,40.49 U3.14 | U3.14 33.57,40.67 35.35,40.67 37.84,43.16 R14.1 | C11.1 47.61,34.8 44.77,34.8 C9.1 44.59,34.8 42.46,34.8 36.59,28.93 28.59,28.93 27.35,30.18 25.21,30.18 | C13.1 35.35,10.97 35.35,13.29 C14.1 35.35,13.46 30.9,13.46 28.41,15.95 | 28.41,15.95 28.77,15.95 30.01,17.2 31.08,17.2 U4.12 | 28.41,15.95 27.7,15.95 | 27.7,15.95 25.39,15.95 U4.5 | 25.21,30.18 25.21,20.58 27.7,18.09 27.7,15.95 | 25.21,30.18 C10.2 25.03,30.36 23.97,31.42 23.97,36.22 25.57,37.82 25.57,39.78 26.81,41.02 26.99,41.02 27.7,41.73 27.7,43.51 28.41,44.22 32.68,44.22 33.39,43.51 33.39,40.67 U3.14
VSUPP
  Top 0.203: CU5_IN.2 58.1,9.37 58.1,10.44 59.35,11.69 U5.3 59.53,11.69 68.24,11.69 68.42,11.51 S1.2